# EAGLE design stm32_board (EAGLE 7.2.0)
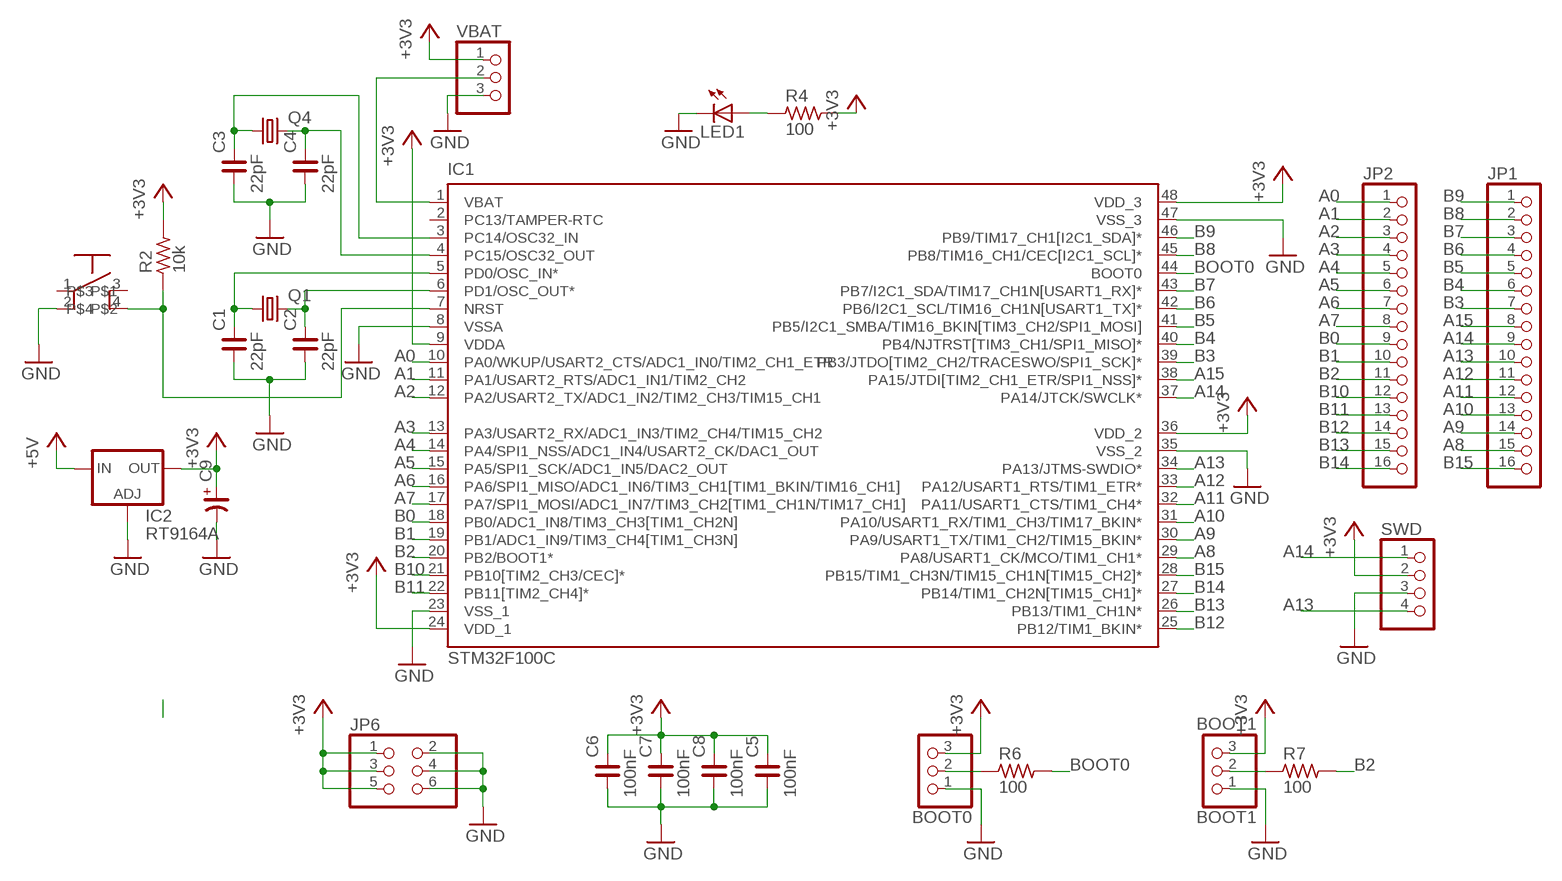
[diagram p0: schematic, sheet 1]

## Parts
BOOT0  PINHD-1X3  [1X03]
BOOT1  BOOT1  PINHD-1X3  [1X03]
C1  22pF  C_1206  [C1206]
C2  22pF  C_1206  [C1206]
C3  22pF  C_1206  [C1206]
C4  22pF  C_1206  [C1206]
C5  100nF  C_1206  [C1206]
C6  100nF  C_1206  [C1206]
C7  100nF  C_1206  [C1206]
C8  100nF  C_1206  [C1206]
C9  CP_SV-D  [CSV-D]
IC1  STM32F100C  [LQFP48]
IC2  RT9164A  LD117ADT33TR  [DPACK]
JP1  PINHD-1X16  [1X16]
JP2  PINHD-1X16  [1X16]
JP6  PINHD-2X3  [2X03]
LED1  LEDCHIPLED_0805  [CHIPLED_0805]
Q1  CRYSTALHC49U-V  [HC49U-V]
Q4  CRYSTALTC26V  [TC26V]
R2  10k  R_1206  [R1206]
R4  100  R_1206  [R1206]
R6  100  R_1206  [R1206]
R7  100  R_1206  [R1206]
S1  BUTTON  [BUTTON]
SWD  PINHD-1X4  [1X04]
VBAT  PINHD-1X3  [1X03]

## Nets
+3V3: BOOT0.3 BOOT1.3 C5.2 C6.2 C7.2 C8.2 C9.+ IC1.9(VDDA) IC1.24(VDD_1) IC1.36(VDD_2) IC1.48(VDD_3) IC2.4(OUT) JP6.1 JP6.3 JP6.5 R2.2 R4.2 SWD.2 VBAT.1
+5V: IC2.3(IN)
A0: IC1.10(PA0/WKUP/USART2_CTS/ADC1_IN0/TIM2_CH1_ETR) JP2.1
A1: IC1.11(PA1/USART2_RTS/ADC1_IN1/TIM2_CH2) JP2.2
A2: IC1.12(PA2/USART2_TX/ADC1_IN2/TIM2_CH3/TIM15_CH1) JP2.3
A3: IC1.13(PA3/USART2_RX/ADC1_IN3/TIM2_CH4/TIM15_CH2) JP2.4
A4: IC1.14(PA4/SPI1_NSS/ADC1_IN4/USART2_CK/DAC1_OUT) JP2.5
A5: IC1.15(PA5/SPI1_SCK/ADC1_IN5/DAC2_OUT) JP2.6
A6: IC1.16(PA6/SPI1_MISO/ADC1_IN6/TIM3_CH1[TIM1_BKIN/TIM16_CH1]) JP2.7
A7: IC1.17(PA7/SPI1_MOSI/ADC1_IN7/TIM3_CH2[TIM1_CH1N/TIM17_CH1]) JP2.8
A8: IC1.29(PA8/USART1_CK/MCO/TIM1_CH1*) JP1.15
A9: IC1.30(PA9/USART1_TX/TIM1_CH2/TIM15_BKIN*) JP1.14
A10: IC1.31(PA10/USART1_RX/TIM1_CH3/TIM17_BKIN*) JP1.13
A11: IC1.32(PA11/USART1_CTS/TIM1_CH4*) JP1.12
A12: IC1.33(PA12/USART1_RTS/TIM1_ETR*) JP1.11
A13: IC1.34(PA13/JTMS-SWDIO*) JP1.10 SWD.4
A14: IC1.37(PA14/JTCK/SWCLK*) JP1.9 SWD.1
A15: IC1.38(PA15/JTDI[TIM2_CH1_ETR/SPI1_NSS]*) JP1.8
B0: IC1.18(PB0/ADC1_IN8/TIM3_CH3[TIM1_CH2N]) JP2.9
B1: IC1.19(PB1/ADC1_IN9/TIM3_CH4[TIM1_CH3N]) JP2.10
B2: IC1.20(PB2/BOOT1*) JP2.11 R7.2
B3: IC1.39(PB3/JTDO[TIM2_CH2/TRACESWO/SPI1_SCK]*) JP1.7
B4: IC1.40(PB4/NJTRST[TIM3_CH1/SPI1_MISO]*) JP1.6
B5: IC1.41(PB5/I2C1_SMBA/TIM16_BKIN[TIM3_CH2/SPI1_MOSI]) JP1.5
B6: IC1.42(PB6/I2C1_SCL/TIM16_CH1N[USART1_TX]*) JP1.4
B7: IC1.43(PB7/I2C1_SDA/TIM17_CH1N[USART1_RX]*) JP1.3
B8: IC1.45(PB8/TIM16_CH1/CEC[I2C1_SCL]*) JP1.2
B9: IC1.46(PB9/TIM17_CH1[I2C1_SDA]*) JP1.1
B10: IC1.21(PB10[TIM2_CH3/CEC]*) JP2.12
B11: IC1.22(PB11[TIM2_CH4]*) JP2.13
B12: IC1.25(PB12/TIM1_BKIN*) JP2.14
B13: IC1.26(PB13/TIM1_CH1N*) JP2.15
B14: IC1.27(PB14/TIM1_CH2N[TIM15_CH1]*) JP2.16
B15: IC1.28(PB15/TIM1_CH3N/TIM15_CH1N[TIM15_CH2]*) JP1.16
BOOT0: IC1.44(BOOT0) R6.2
GND: BOOT0.1 BOOT1.1 C1.1 C2.1 C3.1 C4.1 C5.1 C6.1 C7.1 C8.1 C9.- IC1.8(VSSA) IC1.23(VSS_1) IC1.35(VSS_2) IC1.47(VSS_3) IC2.1(ADJ) JP6.2 JP6.4 JP6.6 LED1.C S1.2 SWD.3 VBAT.3
N$1: C1.2 IC1.5(PD0/OSC_IN*) Q1.1
N$3: C2.2 IC1.6(PD1/OSC_OUT*) Q1.2
N$4: IC1.1(VBAT) VBAT.2
N$5: BOOT0.2 R6.1
N$6: BOOT1.2 R7.1
N$7: IC1.7(NRST) R2.1 S1.4
N$8: LED1.A R4.1
N$9: C3.2 IC1.3(PC14/OSC32_IN) Q4.1
N$12: C4.2 IC1.4(PC15/OSC32_OUT) Q4.2
Unconnected: IC1.2(PC13/TAMPER-RTC) S1.1 S1.3

## Library data of the parts
BOOT0 BOOT1 VBAT = pinhead:PINHD-1X3: PIN HEADER
C1-C8 = rc-master-smd:C_: NON-POLARIZED CAP
C9 = rc-master-smd:CP_: POLARIZED CAP
IC1 = stm_my:STM32F100C
IC2 = v-reg:LD117A?*: Low drop fixed and adjustable positive voltage regulators 1 A Source: http://www.st.com/stonline/products/literature/ds/7194/ld1117axx.pdf
JP1 JP2 = pinhead:PINHD-1X16: PIN HEADER
JP6 = pinhead:PINHD-2X3: PIN HEADER
LED1 = led:LED: LED OSRAM: - CHIPLED LG R971, LG N971, LY N971, LG Q971, LY Q971, LO R971, LY R971 LH N974, LH R974 LS Q976, LO Q976, LY Q976 LO Q996 - Hyper CHIPLED LW Q18S LB Q993, LB Q99A, LB R99A - SideLED LS A670, LO A670, LY A670, LG A670, LP A670 LB A673, LV A673, LT A673, LW A673 LH A674 LY A675 LS A676, LA A676, LO A676, LY A676, LW A676 LS A679, LY A679, LG A679 - Hyper Micro SIDELED® LS Y876, LA Y876, LO Y876, LY Y876 LT Y87S - SmartLED LW L88C, LW L88S LB L89C, LB L89S, LG L890 LS L89K, LO L89K, LY L89K LS L896, LA L896, LO L896, LY L896 - TOPLED LS T670, LO T670, LY T670, LG T670, LP T670 LSG T670, LSP T670, LSY T670, LOP T670, LYG T670 LG T671, LOG T671, LSG T671 LB T673, LV T673, LT T673, LW T673 LH T674 LS T676, LA T676, LO T676, LY T676, LB T676, LH T676, LSB T676, LW T676 LB T67C, LV T67C, LT T67C, LS T67K, LO T67K, LY T67K, LW E67C LS E67B, LA E67B, LO E67B, LY E67B, LB E67C, LV E67C, LT E67C LW T67C LS T679, LY T679, LG T679 LS T770, LO T770, LY T770, LG T770, LP T770 LB T773, LV T773, LT T773, LW T773 LH T774 LS E675, LA E675, LY E675, LS T675 LS T776, LA T776, LO T776, LY T776, LB T776 LHGB T686 LT T68C, LB T68C - Hyper Mini TOPLED® LB M676 - Mini TOPLED Santana® LG M470 LS M47K, LO M47K, LY M47K Source: http://www.osram.convergy.de LUXEON: - LUMILED® LXK2-PW12-R00, LXK2-PW12-S00, LXK2-PW14-U00, LXK2-PW14-V00 LXK2-PM12-R00, LXK2-PM12-S00, LXK2-PM14-U00 LXK2-PE12-Q00, LXK2-PE12-R00, LXK2-PE12-S00, LXK2-PE14-T00, LXK2-PE14-U00 LXK2-PB12-K00, LXK2-PB12-L00, LXK2-PB12-M00, LXK2-PB14-N00, LXK2-PB14-P00, LXK2-PB14-Q00 LXK2-PR12-L00, LXK2-PR12-M00, LXK2-PR14-Q00, LXK2-PR14-R00 LXK2-PD12-Q00, LXK2-PD12-R00, LXK2-PD12-S00 LXK2-PH12-R00, LXK2-PH12-S00 LXK2-PL12-P00, LXK2-PL12-Q00, LXK2-PL12-R00 Source: www.luxeon.com KINGBRIGHT: KA-3528ASYC Source: www.kingbright.com
Q1 = crystal:CRYSTAL: CRYSTAL; OC_FARNELL: 1666969; OC_NEWARK: unknown
Q4 = crystal:CRYSTAL: CRYSTAL; OC_FARNELL: unknown; OC_NEWARK: unknown
R2 R4 R6 R7 = rc-master-smd:R_: RESISTOR
S1 = my_lib:BUTTON
SWD = pinhead:PINHD-1X4: PIN HEADER

## Board
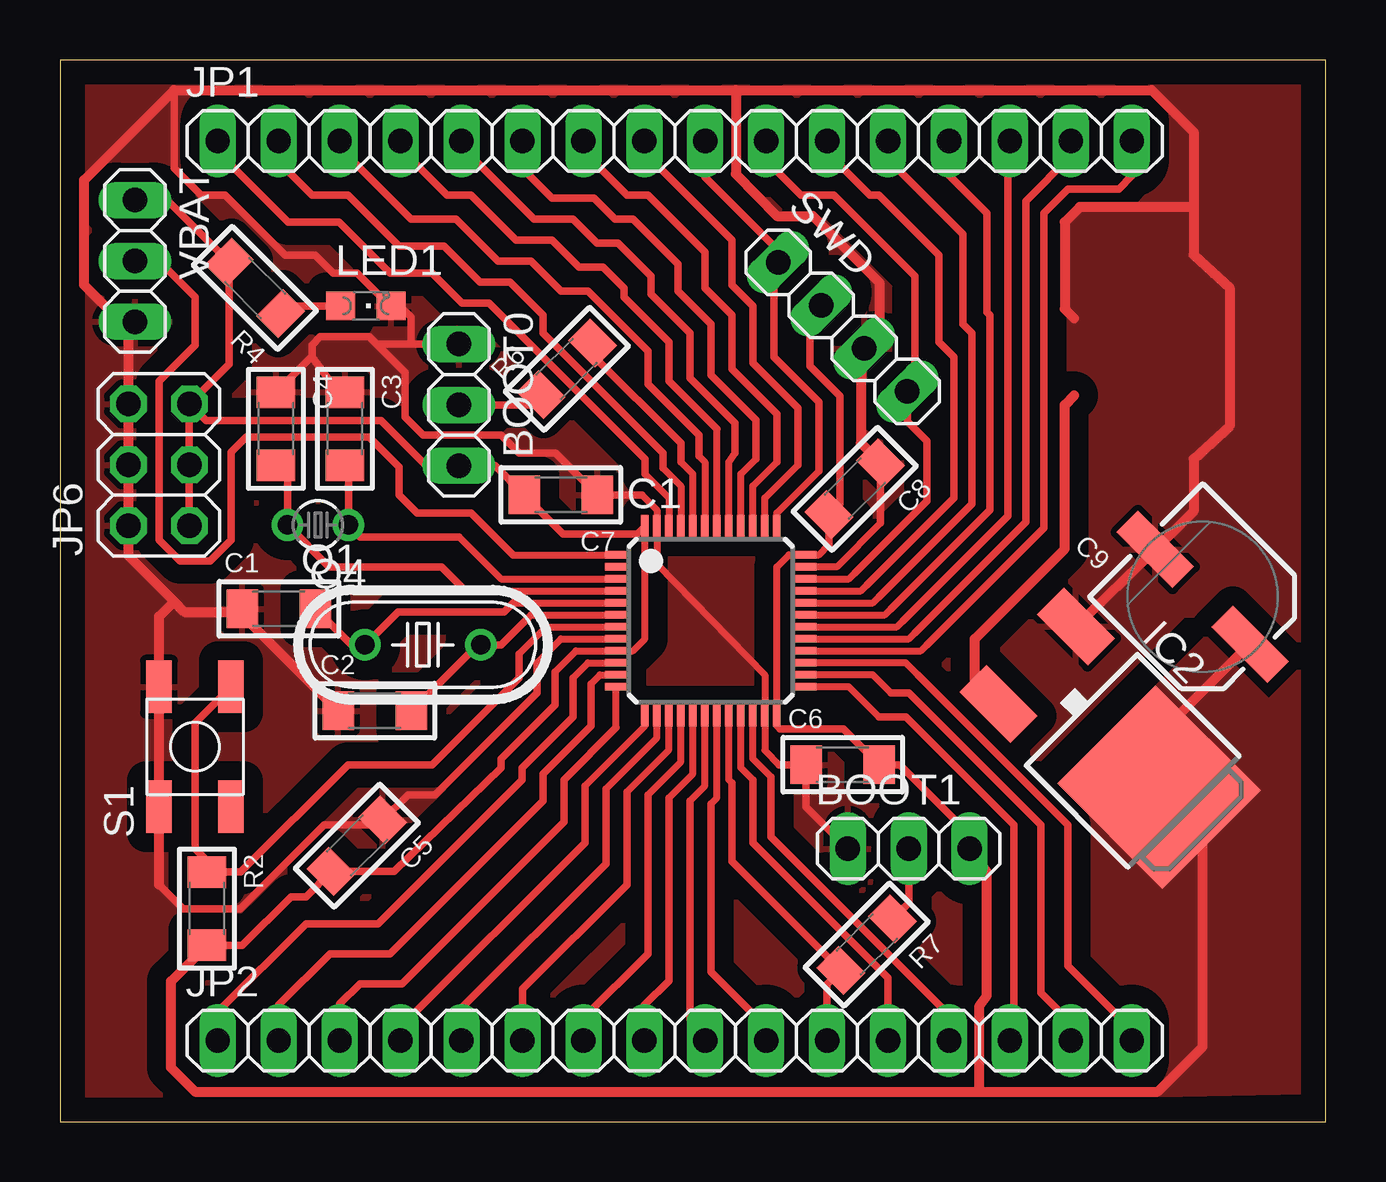
[diagram p1: board, top side]

Size 52.75 x 44.25 mm. Coordinates in mm from the lower left corner, seen from the top.
Outline: 0,0 52.75,0 52.75,44.25 0,44.25 0,0
Copper layers (1*16): Top 0.035mm / dielectric 1.5mm / Bottom 0.035mm
Design rules "default": minimum track width 10mil, minimum drill 24mil, track to track 8mil, track to pad 8mil, pad to pad 8mil, via to via 8mil, smd to smd 8mil, copper to edge 40mil, drill to drill 8mil, minimum pad ring 10mil, minimum via ring 8mil, stop-mask expansion 4mil, vias tented up to drill 0mil, thermal gap 10mil

### Footprints (pad centres in the part's own frame; a part is rotated, then mirrored left to right if it is on the bottom)
1X03 = drill 1.016 long: 1 -2.54,0; 2 0,0; 3 2.54,0
C1206 = smd 1.3 x 1.6: 1 -1.524,0; 2 1.524,0
CSV-D = smd 3.302 x 1.27: + -2.794,0; - 2.794,0
LQFP48 = smd 0.9 x 0.295: 1 -3.95,2.75; 2 -3.95,2.25; 3 -3.95,1.75; 4 -3.95,1.25; 5 -3.95,0.75; 6 -3.95,0.25; 7 -3.95,-0.25; 8 -3.95,-0.75; 9 -3.95,-1.25; 10 -3.95,-1.75; 11 -3.95,-2.25; 12 -3.95,-2.75; 25 3.95,-2.75; 26 3.95,-2.25; 27 3.95,-1.75; 28 3.95,-1.25; 29 3.95,-0.75; 30 3.95,-0.25; 31 3.95,0.25; 32 3.95,0.75; 33 3.95,1.25; 34 3.95,1.75; 35 3.95,2.25; 36 3.95,2.75 | smd 0.295 x 0.9: 13 -2.75,-3.95; 14 -2.25,-3.95; 15 -1.75,-3.95; 16 -1.25,-3.95; 17 -0.75,-3.95; 18 -0.25,-3.95; 19 0.25,-3.95; 20 0.75,-3.95; 21 1.25,-3.95; 22 1.75,-3.95; 23 2.25,-3.95; 24 2.75,-3.95; 37 2.75,3.95; 38 2.25,3.95; 39 1.75,3.95; 40 1.25,3.95; 41 0.75,3.95; 42 0.25,3.95; 43 -0.25,3.95; 44 -0.75,3.95; 45 -1.25,3.95; 46 -1.75,3.95; 47 -2.25,3.95; 48 -2.75,3.95
DPACK = smd 1.6 x 3: 1 -2.28,-4.8; 3 2.28,-4.8 | smd 5.8 x 6.2: 4 0,2.38
1X16 = drill 1.016 long: 1 -19.05,0; 2 -16.51,0; 3 -13.97,0; 4 -11.43,0; 5 -8.89,0; 6 -6.35,0; 7 -3.81,0; 8 -1.27,0; 9 1.27,0; 10 3.81,0; 11 6.35,0; 12 8.89,0; 13 11.43,0; 14 13.97,0; 15 16.51,0; 16 19.05,0
2X03 = drill 1.016 octagon: 1 -2.54,-1.27; 2 -2.54,1.27; 3 0,-1.27; 4 0,1.27; 5 2.54,-1.27; 6 2.54,1.27
CHIPLED_0805 = smd 1.2 x 1.2: A 0,-1.05; C 0,1.05
HC49U-V = drill 0.813: 1 -2.413,0; 2 2.413,0
TC26V = drill 0.813: 1 -1.27,0; 2 1.27,0
R1206 = smd 1.3 x 1.6: 1 -1.524,0; 2 1.524,0
BUTTON = smd 2.184 x 1.067: 1 -2.5,1.5; 2 2.5,1.5; 3 -2.5,-1.5; 4 2.5,-1.5
1X04 = drill 1.016 long: 1 -3.81,0; 2 -1.27,0; 3 1.27,0; 4 3.81,0

### Placement (x,y rotation side)
BOOT0  16.62,29.88 270 top
BOOT1  35.38,11.38 0 top
C1  9.12,21.38 0 top
C2  13.12,17.12 0 top
C3  11.88,28.88 270 top
C4  9,28.88 270 top
C5  12.38,11.5 225 top
C6  32.62,14.88 0 top
C7  20.88,26.12 180 top
C8  33.12,26.38 225 top
C9  47.62,21.88 135 top
IC1  27.12,20.88 0 top
IC2  44.12,15.62 225 top
JP1  25.62,40.88 0 top
JP2  25.62,3.38 0 top
JP6  4.12,27.38 90 top
LED1  12.75,34 270 top
Q1  15.12,19.88 0 top
Q4  10.76,24.86 180 top
R2  6.12,8.88 270 top
R4  8.12,34.75 135 top
R6  21.12,31.38 45 top
R7  33.62,7.38 225 top
S1  5.62,15.62 90 top
SWD  32.62,33.12 315 top
VBAT  3.12,35.88 270 top

### Tracks (layer width: path | path; a pad name or v marks a point on that pad's centre or on a via)
+3V3
  Top 0.295: 30,16.38 29.88,16.5 IC1.24 29.88,23.12 30.38,23.62 IC1.36 31.62,23.62 32.05,24.05 | 20.62,18.75 21.5,19.62 IC1.9 23.88,19.62 24.38,20.12 IC1.48 24.05,24.5
  Top 0.305: 30,16.38 32.65,16.38 C6.2 35,14.88 37.91,11.96 BOOT1.3 | 20.62,18.75 20.62,17.38 18.38,15.12 18.38,14.75 13.92,10.42 C5.2 10.25,9.38 9.62,9.38 7.6,7.35 R2.2 | 32.05,24.05 C8.2 32.5,25.75 32.5,30.25 31.25,31.5 31.25,33.55 SWD.2 | 24.05,24.5 20.98,24.5 C7.2 18.14,27.34 BOOT0.3 15.27,27.34 13.38,29.23 6.08,29.23 JP6.5 | VBAT.1 4.46,38.41 R4.2 7.05,31.57 JP6.5 | JP6.1 JP6.3 JP6.5
  Top 0.406: R2.2 4.62,5.85 4.62,2.25 5.62,1.25 38.33,1.25 | 38.33,1.25 45.75,1.25 47.62,3.12 47.62,12.12 IC2.4 45.81,16.11 C9.+ | 38.33,1.25 38.33,4.83 38.62,5.25 38.62,10.41 BOOT1.3
  pour Top (isolate 0.8, no thermals): 41.75,14.12 47.75,20.12 50.38,17.5 51.88,19 51.88,1.25 45.75,1.12 45.88,3.38 42.5,6.75 42.5,13.38
+5V
  Top 0.406: 42.27,30.27 41.88,29.88 41.88,23.88 38.12,20.12 38.12,18.4 IC2.3
A0
  Top 0.295: IC1.10 22,19.12 21.38,18.5
  Top 0.305: JP2.1 6.58,4.58 10.25,8.25 13.25,8.25 19.25,14.25 19.25,14.75 21.38,16.88 21.38,18.5
A1
  Top 0.295: IC1.11 22.5,18.62 22.12,18.25
  Top 0.305: JP2.2 9.12,4.87 11.25,7 13.75,7 20.12,13.38 20.12,14.5 22.12,16.5 22.12,18.25
A2
  Top 0.295: 22.88,18.12 IC1.12 23.18,16.43
  Top 0.305: 23.18,16.43 21,14.25 21,12.5 14.25,5.75 12.5,5.75 11.65,4.91 JP2.3
A3
  Top 0.295: 21.88,14 24.38,16.5 IC1.13
  Top 0.305: 21.88,14 21.88,11.62 14.2,3.94 JP2.4
A4
  Top 0.295: 22.75,13.88 24.88,16 IC1.14
  Top 0.305: JP2.5 16.73,4.74 22.75,10.75 22.75,13.88
A5
  Top 0.295: 23.62,13.75 25.38,15.5 IC1.15
  Top 0.305: JP2.6 19.27,5.53 23.62,9.88 23.62,13.75
A6
  Top 0.295: 24.5,13.62 25.88,15 IC1.16
  Top 0.305: JP2.7 21.82,4.31 24.5,7 24.5,13.62
A7
  Top 0.295: 25.38,13.5 26.38,14.5 IC1.17
  Top 0.305: JP2.8 24.36,4.86 25.38,5.88 25.38,13.5
A8
  Top 0.295: IC1.29 35.38,20.12 35.62,20.38
  Top 0.305: JP1.15 42.13,40.26 40.25,38.38 40.25,25 35.62,20.38
A9
  Top 0.295: IC1.30 34.88,20.62 35.12,20.88
  Top 0.305: JP1.14 39.59,40.34 39.5,39.62 39.5,25.25 35.12,20.88
A10
  Top 0.295: IC1.31 34.38,21.12 34.62,21.38
  Top 0.305: JP1.13 37.05,39.45 38.62,37.88 38.62,33.75 38.75,33.62 38.75,25.5 34.62,21.38
A11
  Top 0.295: IC1.32 33.88,21.62 34.12,21.88
  Top 0.305: JP1.12 34.52,40.11 37.62,37 37.62,33.25 38,32.88 38,25.75 34.12,21.88
A12
  Top 0.295: IC1.33 33.38,22.12 33.62,22.38
  Top 0.305: JP1.11 31.98,40.4 33.75,38.62 34.12,38.62 36.62,36.12 36.62,32.5 37.25,31.88 37.25,26 33.62,22.38
A13
  Top 0.295: IC1.34 32.88,22.62 33.12,22.88
  Top 0.305: JP1.10 29.43,40.06 30.88,38.62 32.25,38.62 35.62,35.25 35.62,30.74 SWD.4 35.32,29.18 36.12,28.38 36.12,25.88 33.12,22.88
A14
  Top 0.295: IC1.37 29.88,25.38 31.62,27.12
  Top 0.305: 31.62,27.12 31.62,30 29.75,31.88 29.75,35.64 SWD.1 29.93,36.32 26.89,39.35 JP1.9
A15
  Top 0.295: IC1.38 29.38,26 30.75,27.38
  Top 0.305: 30.75,27.38 30.75,29.75 28.88,31.62 28.88,34 28,34.88 28,36.75 24.36,40.4 JP1.8
B0
  Top 0.295: IC1.18 26.88,14 26.25,13.38
  Top 0.305: JP2.9 26.89,3.85 26.88,3.88 26.25,4.25 26.25,13.38
B1
  Top 0.295: IC1.19 27.38,13.5 27.12,13.25
  Top 0.305: 27.12,13.25 27.12,6.25 29.43,3.94 JP2.10
B2
  Top 0.295: IC1.20 27.88,14.25 28,14.12
  Top 0.305: JP2.11 31.98,5.72 R7.2 28,10.85 28,14.12
B3
  Top 0.295: IC1.39 28.88,26.5 29.88,27.5
  Top 0.305: 29.88,27.5 29.88,29.5 28,31.38 28,33.62 26.88,34.75 26.88,36.25 24.5,38.62 23.62,38.62 21.82,40.44 JP1.7
B4
  Top 0.295: IC1.40 28.38,27 29,27.62
  Top 0.305: 29,27.62 29,29.25 27.12,31.12 27.12,33.25 25.75,34.62 25.75,35.75 23.88,37.62 23.12,37.62 22.25,38.5 20.5,38.5 19.27,39.73 JP1.6
B5
  Top 0.295: IC1.41 27.88,27.5 28.12,27.88
  Top 0.305: 28.12,27.88 28.12,29.12 26.25,31 26.25,32.88 24.62,34.5 24.62,35.25 23.25,36.62 22.38,36.62 21.38,37.62 19.75,37.62 16.73,40.64 JP1.5
B6
  Top 0.295: IC1.42 27.38,28.88
  Top 0.305: 27.38,28.88 25.38,30.88 25.38,32.5 23.5,34.38 23.5,34.75 22.62,35.62 21.62,35.62 20.5,36.75 19,36.75 17.12,38.62 16.12,38.62 14.2,40.55 JP1.4
B7
  Top 0.295: IC1.43 26.88,27.5 26.62,27.75
  Top 0.305: 26.62,27.75 26.62,28.62 24.5,30.75 24.5,32.12 22,34.62 20.88,34.62 19.62,35.88 18.25,35.88 16.5,37.62 14.62,37.62 11.65,40.59 JP1.3
B8
  Top 0.295: IC1.45 25.88,26.5 25.12,27.25
  Top 0.305: 25.12,27.25 25.12,27.88 20.12,32.88 20.12,33.62 18.75,35 17.5,35 16,36.5 14.12,36.5 12,38.62 10.5,38.62 9.12,40.01 JP1.2
B9
  Top 0.295: IC1.46 25.38,26 24.38,27
  Top 0.305: 24.38,27 24.38,27.62 17.88,34.12 16.75,34.12 15.5,35.38 13.75,35.38 11.62,37.5 9.5,37.5 6.58,40.42 JP1.1
B10
  Top 0.295: IC1.21 28.38,14.75 28.88,14.25
  Top 0.305: JP2.12 34.52,5.99 28.88,11.62 28.88,14.25
B11
  Top 0.295: IC1.22 28.88,15.12 29.62,14.38
  Top 0.305: JP2.13 37.05,4.45 29.62,11.88 29.62,14.38
B12
  Top 0.295: 34.12,16.88 32.88,18.12 IC1.25
  Top 0.305: 34.12,16.88 35.25,16.88 39.75,12.38 39.75,4.85 39.59,4.57 JP2.14
B13
  Top 0.295: IC1.26 33.88,18.62 34.62,17.88
  Top 0.305: 34.62,17.88 35.38,17.88 40.88,12.37 40.88,5.38 42.13,4.12 JP2.15
B14
  Top 0.295: IC1.27 35.25,19.12 35.75,18.62
  Top 0.305: 35.75,18.62 42,12.38 42,6.5 44.67,3.83 JP2.16
B15
  Top 0.295: IC1.28 35.88,19.62 36.12,19.88
  Top 0.305: JP1.16 44.67,39.42 44.12,38.88 42,38.88 41,37.88 41,24.75 36.12,19.88
BOOT0
  Top 0.295: IC1.44 26.38,27 25.88,27.5
  Top 0.305: 25.88,27.5 25.88,28.28 22.2,31.95 R6.2
GND
  Top 0.295: 29.98,14.88 29.38,15.48 IC1.23 29.38,18.62 24.88,23.25 IC1.47 24.88,25.5 24.25,26.12 | IC1.35 32.38,23.12 34.2,24.95 | IC1.8 20.88,20.12 19.88,19.12
  Top 0.305: 29.98,14.88 C6.1 31.1,13.11 BOOT1.1 | C3.1 11.6,30.4 10.5,31.88 10.5,31.9 | C8.1 34.2,24.95 | 19.88,19.12 19.88,17.88 15.62,13.62 14.5,13.62 C5.1 13.25,12.38 11,12.38 7.5,8.88 5.12,8.88 4.12,9.88 | 24.25,26.12 C7.1 20.65,27.88 19.12,27.88 18.38,28.62 15.12,28.62 14.38,29.38 14.38,31.23 13.19,32.41 | 14.62,32.41 13.19,32.41 | 14.62,32.41 BOOT0.1 | 13.19,32.41 12.88,32.72 10.85,32.72 10.5,32.38 10.5,31.9 | 4.75,43 4.75,39.75 5.88,38.62 6.88,38.62 9.38,36.12 10.62,36.12 11.38,35.38 12.38,35.38 13.25,34.5 13.55,34.38 LED1.C 14.16,34 14.62,33.54 14.62,32.41 | 10.5,31.9 C4.1 | 7.48,21.25 C1.1
  Top 0.406: 28.18,43 28.18,39.5 29.88,37.75 31.38,37.75 34.15,34.98 34.15,32.85 SWD.3 33.38,32.08 33.38,28.28 C8.1 | 28.18,43 45.5,43 47.25,41.25 47.25,38.12 | 4.12,9.88 S1.2 4.12,21.06 4.75,21.69 | 28.18,43 4.75,43 1,39.25 1,34.88 2.54,33.34 VBAT.3 2.85,33.06 JP6.6 JP6.4 JP6.2 2.85,23.58 4.75,21.69 | 47.25,38.12 47.25,36.12 48.75,34.75 48.75,29 47.25,27.62 47.25,25.45 C9.- IC2.1 | 47.25,38.12 42.5,38.12 41.88,37.5 41.88,33.88 42.27,33.48 | 4.75,21.69 5.19,21.25 7.48,21.25 C2.1
  pour Top: 24.88,23.25 29.12,18.88 29.38,18.62
  pour Top (isolate 0.8, rank 2): 52.75,44.25 0,44.25 0,0 52.75,0
N$1
  Top 0.295: 18.88,21.62 IC1.5
  Top 0.305: 18.88,21.62 18.5,21.25 14.09,21.25 Q1.1 12.15,19.88 C1.2
N$3
  Top 0.295: IC1.6 19.62,21.12 19.5,21
  Top 0.305: 19.5,21 18.38,19.88 Q1.2 17.4,19.88 C2.2
N$4
  Top 0.295: 18.88,23.62 IC1.1
  Top 0.305: 18.88,23.62 17.12,25.38 14.88,25.38 14.12,26.12 14.12,27.27 12.88,28.52 7.75,28.52 7.12,27.9 7.12,24.25 6.25,23.38 5,23.38 4.12,24.25 4.12,30.88 5.62,32.38 5.62,34.38 4.12,35.88 VBAT.2
N$5
  Top 0.305: BOOT0.2 19.62,29.88 R6.1
N$6
  Top 0.305: R7.1 35.38,9.12 BOOT1.2
N$7
  Top 0.295: IC1.7 20.25,20.62 19.12,19.5
  Top 0.305: 19.12,19.5 19.12,18.5 15.5,14.88 12,14.88 7.52,10.4 R2.1 6.12,10.88 5.62,11.38 5.62,16.62 S1.4
N$8
  Top 0.305: LED1.A 9.53,34 R4.1
N$9
  Top 0.295: IC1.3 18.38,22.62 16.62,24.38
  Top 0.305: 16.62,24.38 12.52,24.38 Q4.1 12.03,27.2 C3.2
N$12
  Top 0.295: 16.9,22.12 IC1.4
  Top 0.305: C4.2 9.48,26.87 Q4.2 11.22,23.12 15.9,23.12 16.9,22.12